# Altium schematic sheet INPUT_OUPUT.SchDoc: power
size A4; DrawnBy: Patryk Bujak; DocumentNumber: 12; Revision: 1.0; SheetNumber: 12; SheetTotal: 14
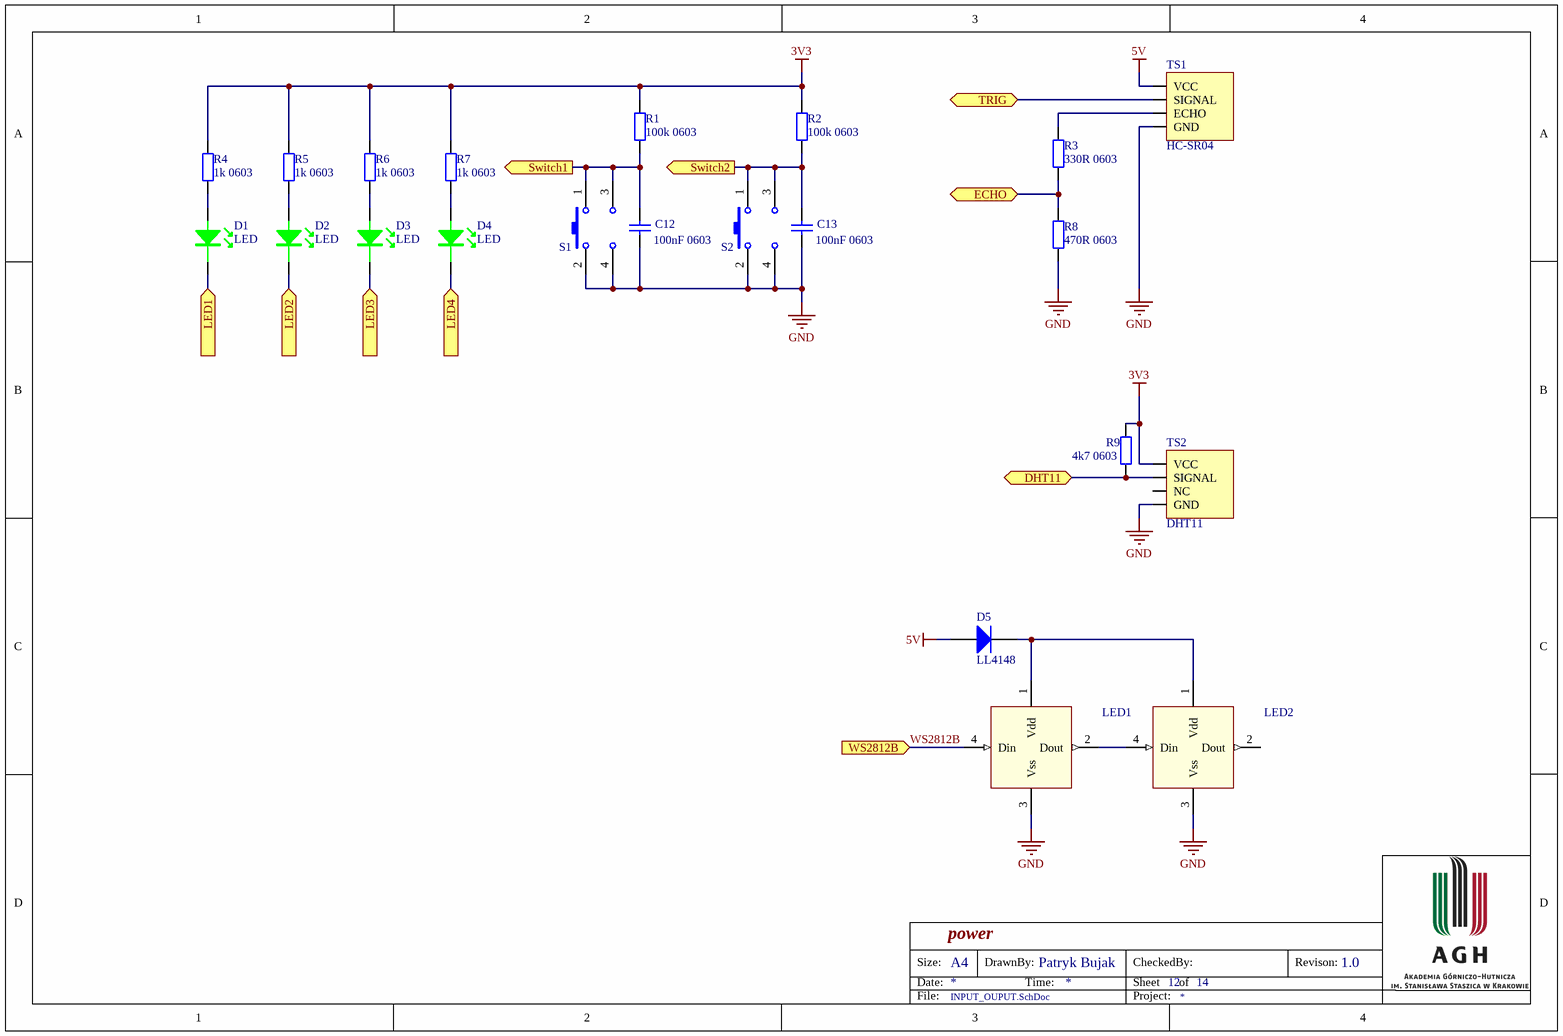
[diagram p0: INPUT_OUPUT.SchDoc]

## Parts
C12  100nF 0603  [C_0603]
C13  100nF 0603  [C_0603]
D1  LED  [LED_1206_GREEN]
D2  LED  [LED_1206_GREEN]
D3  LED  [LED_1206_GREEN]
D4  LED  [LED_1206_GREEN]
D5  LL4148  [MINIMELF_DIODA_REFLOW]
LED1  WS2812B  [WS2812B]  (value not drawn)
LED2  WS2812B  [WS2812B]  (value not drawn)
R1  100k 0603  [R_0603]
R2  100k 0603  [R_0603]
R3  330R 0603  [R_0603]
R4  1k 0603  [R_0603]
R5  1k 0603  [R_0603]
R6  1k 0603  [R_0603]
R7  1k 0603  [R_0603]
R8  470R 0603  [R_0603]
R9  4k7 0603  [R_0603]
S1  tact_switch  [RESET-1]  (value not drawn)
S2  tact_switch  [RESET-1]  (value not drawn)
TS1  HC-SR04  [HC-SR04]
TS2  DHT11  [DHT11]

## Ports
DHT11, ECHO, LED1 (in), LED2 (in), LED3 (in), LED4 (in), Switch1 (out), Switch2 (out), TRIG, WS2812B (in)

## Nets
3V3: R1.2 R2.2 R4.2 R5.2 R6.2 R7.2 R9.2 TS2.1(VCC)
5V: D5.1(A) TS1.4(VCC)
GND: C12.2 C13.2 LED1.3(Vss) LED2.3(Vss) R8.1 S1.2 S1.4 S2.2 S2.4 TS1.1(GND) TS2.4(GND)
DHT11: R9.1 TS2.2(SIGNAL) ; port DHT11
ECHO: R3.1 R8.2 ; port ECHO
LED1: D1.2(K) ; port LED1
LED2: D2.2(K) ; port LED2
LED3: D3.2(K) ; port LED3
LED4: D4.2(K) ; port LED4
Switch1: C12.1 R1.1 S1.1 S1.3 ; port Switch1
Switch2: C13.1 R2.1 S2.1 S2.3 ; port Switch2
TRIG: TS1.3(SIGNAL) ; port TRIG
WS2812B: LED1.4(Din) ; port WS2812B
NetD1_1: D1.1(A) R4.1
NetD2_1: D2.1(A) R5.1
NetD3_1: D3.1(A) R6.1
NetD4_1: D4.1(A) R7.1
NetD5_2: D5.2(K) LED1.1(Vdd) LED2.1(Vdd)
NetLED1_2: LED1.2(Dout) LED2.4(Din)
NetR3_2: R3.2 TS1.2(ECHO)

Not connected (* = marked no-connect by the designer): LED2 2(Dout); TS2 3(NC)

## Notes on the sheet
- Size:
- Date:
- A4
- DrawnBy:
- Time:
- Sheet
- CheckedBy:
- of
- Revison:
- File:
- Project:

## Library data of the parts
C12 C13 = Cap: Generic capacitor; value: 100n; dielectric: X7R; voltage: 25V
D1-D4 = LED_GREEN
D5 = Diode: Default Diode; Published: 8-Jun-2000; LatestRevisionDate: 17-Jul-2002; LatestRevisionNote: Re-released for DXP Platform.; PackageVersion: Sep-1996; PackageReference: SMC; Publisher: Altium Limited; PackageDescription: DO-214-AB/SMC; 2 C-Bend Leads; Body 7.9 x 5.9 mm, inc. leads (LxW); Code_JEDEC: DO-214-AB
R1-R9 = Res2: Resistor
S1 S2 = tact_switch: Switch; Manufacturer: Generic Components; Published: 24-Mar-1999; Revision: July-2002: Re-released for DXP Platform.; Publisher: Altium Limited
TS1 = DHT11